# EasyEDA Pro project Source_Boat-Board.epro, board PCB2_2
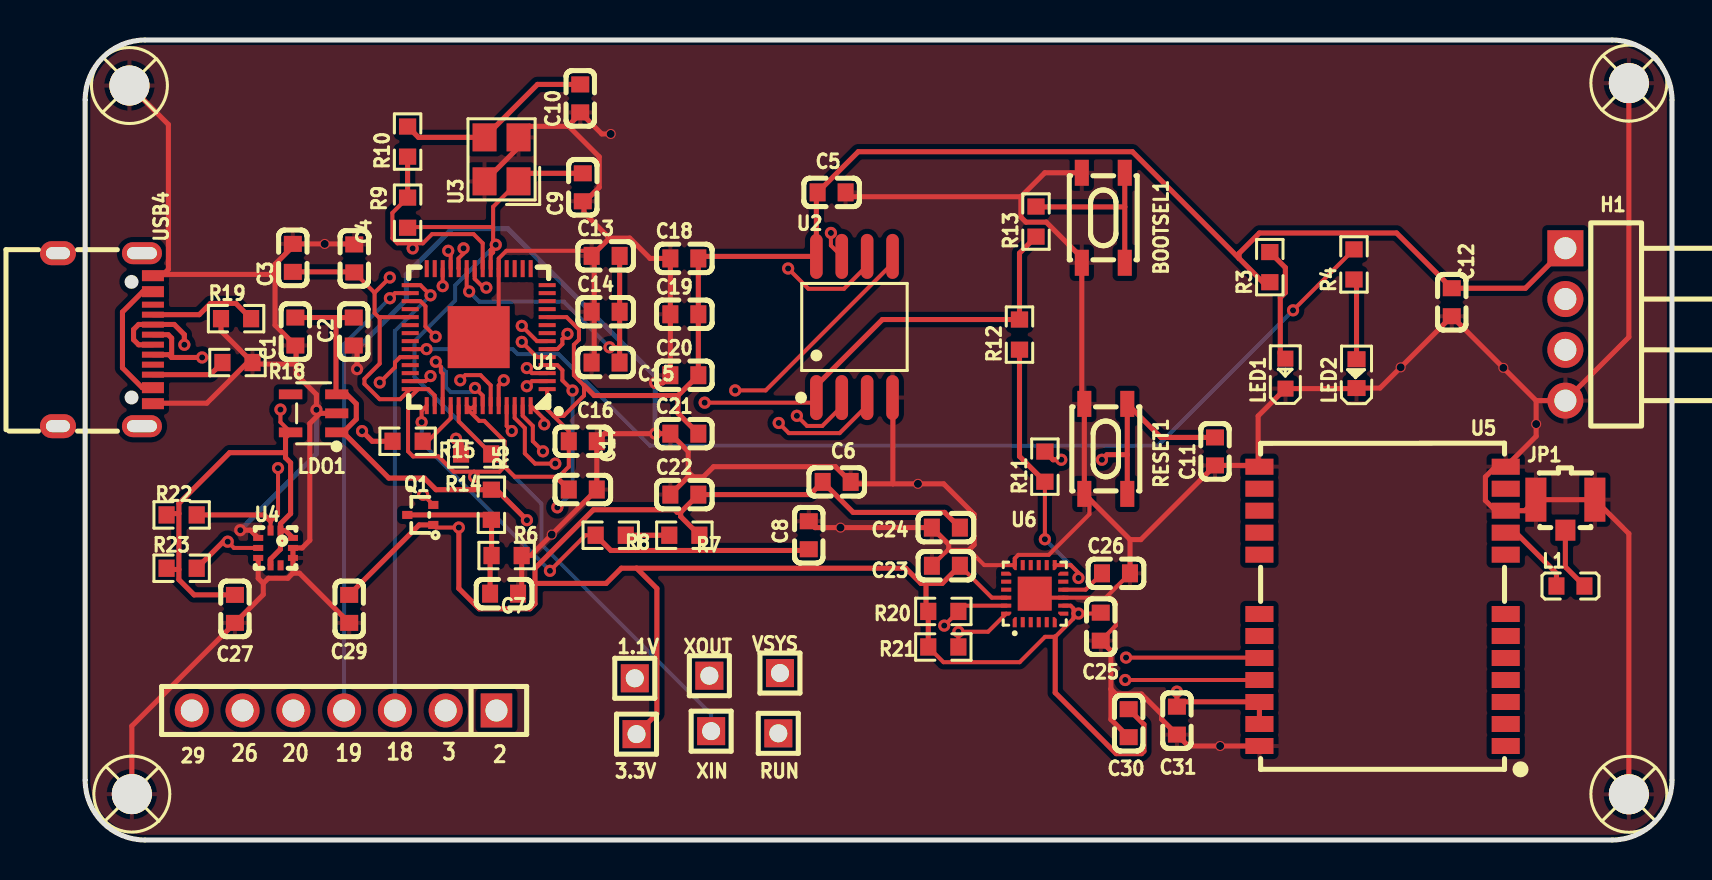
[diagram p5: board, top side]
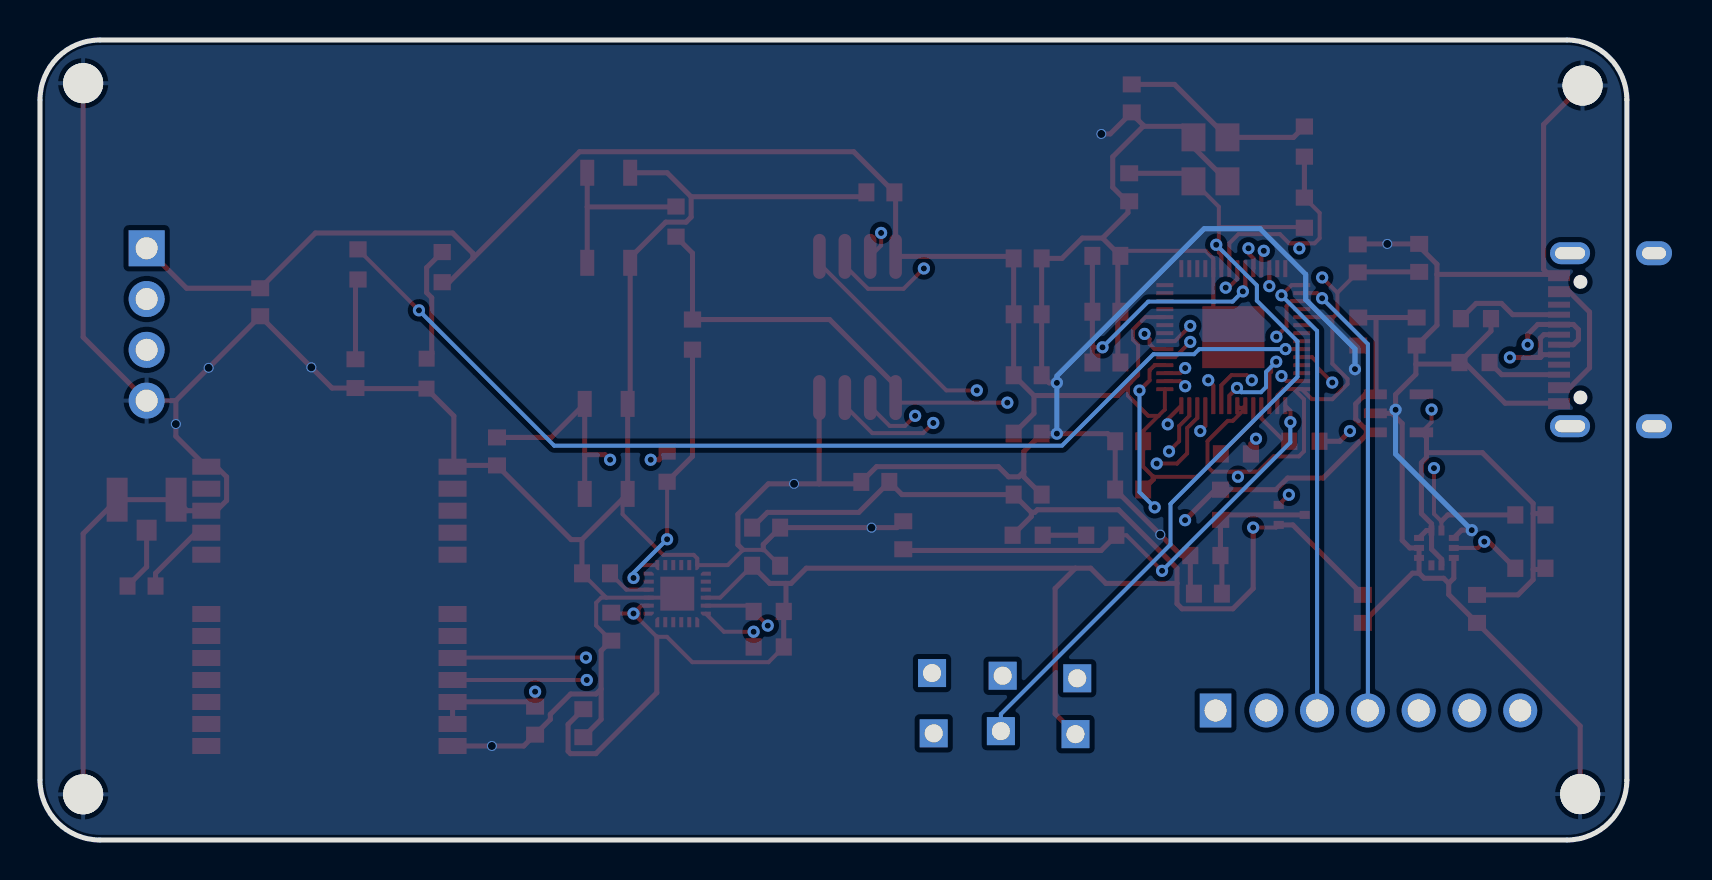
[diagram p6: board, bottom side, seen from below]

Outline 79.37 x 40 mm; copper layers: Top Layer, Inner1, Inner2, Bottom Layer. Coordinates in mm from the lower left corner of the outline.
Outline path: 0,37 0,3 arc(0.88,0.88) 3,0 76.37,0 arc(78.5,0.88) 79.37,3 79.37,37 arc(78.5,39.13) 76.37,40 3,40 arc(0.88,39.13) 0,37
Stack: Top Layer 0.035mm Outer layer thickness 1oz / Dielectric1 0.2104mm 7628 RC49% 8.6mil / Inner1 0.0152mm Inner layer thickness / Dielectric2 1.065mm 1.1mm H/HOZ Copper / Inner2 0.0152mm Inner layer thickness / Dielectric3 0.2104mm 7628 RC49% 8.6mil / Bottom Layer 0.035mm Outer layer thickness 1oz

## Design rules (mm)
template: JLCPCB Capability(Two Layers Board)
spacing copperThickness1oz (default): track to track 0.102, other pairs 0.152 to 0.3
spacing copperThickness2oz: track to track 0.203, other pairs 0.152 to 0.3
track width copperThickness1oz (default): min 0.127, default 0.254, max 2.54
track width copperThickness2oz: min 0.203, default 0.254, max 2.54
differential pair differentialPair (default): width min 0.127, default 0.254, max 2.54; gap min 0.152, default 0.152
via viaSize (default): diameter min 0.5, default 0.61, max 10; hole min 0.3, default 0.305, max 6.3

## Placement (name value [footprint] x y rotation side)
1.1V  -  [HDR-TH_1P-V-M_XKB_X4611WV-01I-C28D40]  27.49 8.09 90 top
3.3V  -  [HDR-TH_1P-V-M_XKB_X4611WV-01I-C28D40]  27.58 5.29 90 top
29  -  [HDR-TH_7P-P2.54-V-F]  12.95 6.48 180 top
BOOTSEL1  PTS815SJK250SMTRLFS  [SW-SMD_4P-L4.2-W3.3-P2.15-LS5.1]  50.93 31.12 90 top
C1  2.2uF  [C0603]  10.51 25.43 90 top
C2  100nF  [C0603]  13.44 25.43 90 top
C3  2.2uF  [C0603]  10.39 29.11 90 top
C4  100nF  [C0603]  13.46 29.08 270 top
C5  100nF  [C0603]  37.34 32.39 0 top
C6  2.2uF  [C0603]  37.59 17.91 0 top
C7  100nF  [C0603]  20.95 12.32 180 top
C8  2.2uF  [C0603]  36.2 15.24 90 top
C9  15pF  [C0603]  24.89 32.64 90 top
C10  15pF  [C0603]  24.77 37.08 90 top
C11  100nF  [C0603]  56.52 19.43 90 top
C12  100nF  [C0603]  68.36 26.89 270 top
C13  100nF  [C0603]  26.03 29.21 0 top
C14  100nF  [C0603]  26.03 26.42 0 top
C15  2.2uF  [C0603]  26.03 23.88 180 top
C16  2.2uF  [C0603]  24.89 19.94 0 top
C17  100nF  [C0603]  24.89 17.53 180 top
C18  100nF  [C0603]  29.97 29.08 0 top
C19  100nF  [C0603]  29.97 26.29 0 top
C20  100nF  [C0603]  29.97 23.24 0 top
C21  100nF  [C0603]  29.97 20.32 0 top
C22  100nF  [C0603]  29.97 17.27 0 top
C23  100nF  [C0603]  43.05 13.71 0 top
C24  2.2uF  [C0603]  43.05 15.62 180 top
C25  100nF  [C0603]  50.8 10.67 90 top
C26  100nF  [C0603]  51.56 13.34 0 top
C27  100nF  [C0603]  7.49 11.56 90 top
C29  100nF  [C0603]  13.21 11.56 90 top
C30  100nF  [C0603]  52.2 5.84 90 top
C31  2.2uF  [C0603]  54.61 5.97 270 top
H1  DZ254W-11-04-65  [HDR-TH_4P-P2.54-H-M-W10.3]  74.04 25.78 270 top
JP1  6GHz  [RF-SMD_FRF05002-JSS103M]  74.04 16.26 0 top
L1  33nH  [L0603]  74.3 12.7 0 top
LDO1  ME6211C33M5G-N  [SOT-23-5_L3.0-W1.7-P0.95-LS2.8-BL]  11.43 21.34 90 top
LED1  NCD0603R1  [LED0603-RD_RED]  60.04 23.32 90 top
LED2  19-217/BHC-ZL1M2RY/3T  [LED0603-FD_BLUE]  63.59 23.32 90 top
Q1  DMG1012T-7  [SOT-523-3_L1.6-W0.8-P1.00-LS1.6-BR]  16.76 16.26 0 top
R3  1kΩ  [R0603]  59.26 28.65 90 top
R4  470Ω  [R0603]  63.47 28.78 90 top
R5  200kΩ  [R0603]  20.32 16.76 270 top
R6  100kΩ  [R0603]  21.08 14.22 180 top
R7  200Ω  [R0603]  29.97 15.24 180 top
R8  1Ω  [R0603]  26.29 15.24 180 top
R9  NO FIT  [R0603]  16.13 31.37 90 top
R10  1kΩ  [R0603]  16.13 34.92 90 top
R11  10kΩ  [R0603]  48.01 18.67 90 top
R12  NO-FIT  [R0603]  46.74 25.27 90 top
R13  1kΩ  [R0603]  47.56 30.92 90 top
R14  27Ω  [R0603]  19.56 19.3 180 top
R15  27Ω  [R0603]  16.13 19.94 180 top
R18  5.1K  [R0603]  7.62 23.88 180 top
R19  5.1K  [R0603]  7.55 26.07 0 top
R20  4.7K  [R0603]  42.93 11.43 180 top
R21  4.7K  [R0603]  42.93 9.65 180 top
R22  4.7K  [R0603]  4.83 16.26 180 top
R23  4.7K  [R0603]  4.83 13.59 180 top
RESET1  PTS815SJK250SMTRLFS  [SW-SMD_4P-L4.2-W3.3-P2.15-LS5.1]  51.05 19.56 90 top
RUN   -  [HDR-TH_1P-V-M_XKB_X4611WV-01I-C28D40]  34.67 5.33 90 top
SCREW1  -  [Screw-Hole-M2]  77.22 2.29 0 top
SCREW2  -  [Screw-Hole-M2]  77.22 37.85 0 top
SCREW3  -  [Screw-Hole-M2]  2.22 37.73 0 top
SCREW4  -  [Screw-Hole-M2]  2.33 2.3 0 top
U1  RP2040  [LQFN-56_L7.0-W7.0-P0.4-EP]  19.68 25.15 180 top
U2  W25Q128JVSIQ  [SOIC-8_L5.3-W5.3-P1.27-LS8.0-BL]  38.48 25.65 0 top
U3  12MHz  [CRYSTAL-SMD_4P-L3.2-W2.5-BL]  20.83 34.04 90 top
U4  BMP388  [SENSORM-SMD_BMP388]  9.52 14.61 0 top
U5  M216Z-D80  [LCC-24_L16.3-W12.2_NEO-NEO-M10]  64.9 11.68 270 top
U6  ICM-20948  [QFN-24_L3.0-W3.0-P0.40-BL-EP]  47.5 12.32 0 top
USB4  TYPE-C 16PIN 2MD(073)  [USB-C-SMD_TYPE-C-16PIN-2MD-073]  1.02 25.02 270 top
VSYS  -  [HDR-TH_1P-V-M_XKB_X4611WV-01I-C28D40]  34.75 8.35 90 top
XIN  -  [HDR-TH_1P-V-M_XKB_X4611WV-01I-C28D40]  31.31 5.44 90 top
XOUT  -  [HDR-TH_1P-V-M_XKB_X4611WV-01I-C28D40]  31.22 8.21 90 top

## Footprints (pads in the part's own frame, mm; a bottom-side part is the same pattern mirrored in y, then rotated)
C0603
  rect 0.8x0.9 smd: 1(-0.7,0) 2(0.7,0)
CRYSTAL-SMD_4P-L3.2-W2.5-BL
  rect 1.4x1.2 smd: 1(-1.1,-0.85) 2(1.1,-0.85) 3(1.1,0.85) 4(-1.1,0.85)
HDR-TH_1P-V-M_XKB_X4611WV-01I-C28D40
  rect 1.4x1.4 hole 0.9: 1(0,0)
HDR-TH_4P-P2.54-H-M-W10.3
  rect 1.8x1.8 hole 1.1: 1(-3.81,0)
  round 1.8 hole 1.1: 2(-1.27,0) 3(1.27,0) 4(3.81,0)
HDR-TH_7P-P2.54-V-F
  rect 1.575x1.7 hole 1.1: 1(-7.62,0)
  round 1.7 hole 1.1: 2(-5.08,0) 3(-2.54,0) 4(0,0) 5(2.54,0) 6(5.08,0) 7(7.62,0)
L0603
  rect 0.8x0.864 smd: 1(-0.7,0) 2(0.7,0)
LCC-24_L16.3-W12.2_NEO-NEO-M10
  rect 0.8x1.403 smd: 1(6.983,6.16) 2(5.883,6.16) 3(4.783,6.16) 4(3.683,6.16) 5(2.583,6.16) 6(1.483,6.16) 7(0.383,6.16) 8(-2.583,6.16) 9(-3.683,6.16) 10(-4.783,6.16) 11(-5.883,6.16) 12(-6.983,6.16) 13(-6.983,-6.16) 14(-5.883,-6.16) 15(-4.783,-6.16) 16(-3.683,-6.16) 17(-2.583,-6.16) 18(0.383,-6.16) 19(1.483,-6.16) 20(2.583,-6.16) 21(3.683,-6.16) 22(4.783,-6.16) 23(5.883,-6.16) 24(6.983,-6.16)
LED0603-FD_BLUE
  rect 0.8x0.9 smd: 1(-0.72,0) 2(0.72,0)
LED0603-RD_RED
  rect 0.8x0.8 smd: 1(-0.749,-0.004) 2(0.749,0.004)
LQFN-56_L7.0-W7.0-P0.4-EP
  rect 0.85x0.2 smd: 1(-3.425,2.6) 2(-3.425,2.2) 3(-3.425,1.8) 4(-3.425,1.4) 5(-3.425,1) 6(-3.425,0.6) 7(-3.425,0.2) 8(-3.425,-0.2) 9(-3.425,-0.6) 10(-3.425,-1) 11(-3.425,-1.4) 12(-3.425,-1.8) 13(-3.425,-2.2) 14(-3.425,-2.6) 29(3.425,-2.6) 30(3.425,-2.2) 31(3.425,-1.8) 32(3.425,-1.4) 33(3.425,-1) 34(3.425,-0.6) 35(3.425,-0.2) 36(3.425,0.2) 37(3.425,0.6) 38(3.425,1) 39(3.425,1.4) 40(3.425,1.8) 41(3.425,2.2) 42(3.425,2.6)
  rect 0.2x0.85 smd: 15(-2.6,-3.425) 16(-2.2,-3.425) 17(-1.8,-3.425) 18(-1.4,-3.425) 19(-1,-3.425) 20(-0.6,-3.425) 21(-0.2,-3.425) 22(0.2,-3.425) 23(0.6,-3.425) 24(1,-3.425) 25(1.4,-3.425) 26(1.8,-3.425) 27(2.2,-3.425) 28(2.6,-3.425) 43(2.6,3.425) 44(2.2,3.425) 45(1.8,3.425) 46(1.4,3.425) 47(1,3.425) 48(0.6,3.425) 49(0.2,3.425) 50(-0.2,3.425) 51(-0.6,3.425) 52(-1,3.425) 53(-1.4,3.425) 54(-1.8,3.425) 55(-2.2,3.425) 56(-2.6,3.425)
  rect 3.1x3.1 smd: 57(0,0)
QFN-24_L3.0-W3.0-P0.40-BL-EP
  custom 0.2x0.506 smd: 1(-1,-1.427) 6(1,-1.427) 13(1,1.427) 18(-1,1.427)
  rect 0.2x0.505 smd: 2(-0.6,-1.427) 3(-0.2,-1.427) 4(0.2,-1.427) 5(0.6,-1.427) 14(0.6,1.427) 15(0.2,1.427) 16(-0.2,1.427) 17(-0.6,1.427)
  custom 0.506x0.2 smd: 7(1.427,-1) 12(1.427,1) 19(-1.427,1) 24(-1.427,-1)
  rect 0.505x0.2 smd: 8(1.427,-0.6) 9(1.427,-0.2) 10(1.427,0.2) 11(1.427,0.6) 20(-1.427,0.6) 21(-1.427,0.2) 22(-1.427,-0.2) 23(-1.427,-0.6)
  rect 1.7x1.7 smd: 25(0,0)
R0603
  rect 0.806x0.864 smd: 1(-0.753,0) 2(0.753,0)
RF-SMD_FRF05002-JSS103M
  rect 1x1.05 smd: 1(0,-0.762)
  rect 1.05x2.2 smd: 2(-1.475,0.762) 3(1.475,0.762)
Screw-Hole-M2
  round 2 hole 2: 1(0,0)
SENSORM-SMD_BMP388
  rect 0.3x0.5 smd: 1(0.25,0.871) 2(-0.25,0.871) 6(-0.25,-0.871) 7(0.25,-0.871)
  rect 0.5x0.3 smd: 3(-0.869,0.5) 4(-0.869,0) 5(-0.869,-0.5) 8(0.869,-0.5) 9(0.869,0) 10(0.869,0.5)
SOIC-8_L5.3-W5.3-P1.27-LS8.0-BL
  oval 0.63x2.25 smd: 1(-1.905,-3.53) 2(-0.635,-3.53) 3(0.635,-3.53) 4(1.905,-3.53) 5(1.905,3.53) 6(0.635,3.53) 7(-0.635,3.53) 8(-1.905,3.53)
SOT-23-5_L3.0-W1.7-P0.95-LS2.8-BL
  rect 0.49x1.157 smd: 1(-0.95,-1.153) 2(0,-1.153) 3(0.95,-1.153)
  rect 0.49x1.175 smd: 4(0.95,1.153) 5(-0.95,1.153)
SOT-523-3_L1.6-W0.8-P1.00-LS1.6-BR
  rect 0.51x0.4 smd: 1(0.65,-0.5) 2(0.65,0.5) 3(-0.65,0)
SW-SMD_4P-L4.2-W3.3-P2.15-LS5.1
  rect 1.3x0.701 smd: 1(-2.251,1.075) 2(2.251,1.075) 3(-2.251,-1.075) 4(2.251,-1.075)
USB-C-SMD_TYPE-C-16PIN-2MD-073
  oval 1.1x2 hole 0.6x1.5: 13(-4.325,1.825) 14(4.325,1.825)
  oval 1.2x1.8 hole 0.6x1.2: 13(-4.325,-2.375) 14(4.325,-2.375)
  rect 0.55x1.1 smd: A1B12(-3.2,2.375) A4B9(-2.4,2.375) B1A12(3.2,2.375) B4A9(2.4,2.375)
  rect 0.3x1.1 smd: A5(-1.25,2.375) A6(-0.25,2.375) A7(0.25,2.375) A8(1.25,2.375) B5(1.75,2.375) B6(0.75,2.375) B7(-0.75,2.375) B8(-1.75,2.375)

## Nets
1V1: 1.1V.1 C13.2 C14.2 C15.1 U1.23 U1.45 U1.50
3V3: 3.3V.1 C3.1 C4.2 C5.1 C6.1 C12.1 C16.1 C17.2 C18.2 C19.2 C20.2 C21.2 C22.2 C23.2 C24.1 C25.2 C27.2 C29.2 C30.2 C31.1 H1.1 LDO1.5 Q1.1 R3.1 R7.1 R11.1 R12.1 R20.2 R21.2 R22.2 R23.2 U1.1 U1.10 U1.22 U1.33 U1.42 U1.44 U1.48 U1.49 U2.8 U4.1 U4.6 U4.10 U5.22 U5.23 U6.8 U6.13 U6.22
GND: BOOTSEL1.1 BOOTSEL1.2 C1.1 C2.1 C3.2 C4.1 C5.2 C6.2 C7.1 C8.2 C9.1 C10.1 C11.1 C12.2 C13.1 C14.1 C15.2 C16.2 C17.1 C18.1 C19.1 C20.1 C21.1 C22.1 C23.1 C24.2 C25.1 C26.2 C27.1 C29.1 C30.1 C31.2 H1.4 JP1.2 JP1.3 LDO1.2 LED1.1 LED2.1 R6.1 R18.1 R19.1 RESET1.1 RESET1.2 SCREW1.1 SCREW2.1 SCREW3.1 SCREW4.1 U1.19 U1.57 U2.4 U3.2 U3.4 U4.3 U4.5 U4.8 U4.9 U5.10 U5.12 U5.13 U5.24 U6.9 U6.18 U6.25 USB4.A1B12 USB4.B1A12
VBUS: USB4.A4B9 USB4.B4A9
ADC_AVDD: C8.1 R8.2 U1.43
ADC_VREF: R7.2 R8.1
ANTENA: JP1.1 L1.2
GPIO25: R4.2 U1.37
GPIO29_ADC3: 29.7 Q1.2 U1.41
GPSRX: U1.2 U5.21
GPSTX: U1.3 U5.20
IO2: 29.1 U1.4
IO3: 29.2 U1.5
IO18: 29.3 U1.29
IO19: 29.4 U1.30
IO20: 29.5 U1.31
IO26: 29.6 U1.38
QSPI_SCLK: U1.52 U2.6
QSPI_SD0: U1.53 U2.5
QSPI_SD1: U1.55 U2.2
QSPI_SD2: U1.54 U2.3
QSPI_SD3: U1.51 U2.7
QSPI_SS: R12.2 R13.1 U1.56 U2.1
RUN: C11.2 R11.2 RESET1.3 RESET1.4 RUN .1 U1.26
SCL: R20.1 R22.1 U1.7 U4.2 U6.23
SDA: R21.1 R23.1 U1.6 U4.4 U6.24
SWCLK: H1.3 U1.24
SWD: H1.2 U1.25
USBD+: R14.2 USB4.A6 USB4.B6
USBD-: R15.2 USB4.A7 USB4.B7
VSYS: C1.2 C2.2 LDO1.1 LDO1.3 R5.1 VSYS.1
XIN: C9.2 R9.1 U1.20 U3.1 XIN.1
XOUT: R9.2 R10.1 U1.21 XOUT.1
$1N19406: LED1.2 R3.2
$1N19408: LED2.2 R4.1
$1N19463: BOOTSEL1.3 BOOTSEL1.4 R13.2
$1N19510: R14.1 U1.47
$1N19539: R15.1 U1.46
$1N19579: C10.2 R10.2 U3.3
$1N19631: C7.2 Q1.3 R5.2 R6.2
$1N20843: R19.2 USB4.A5
$1N20865: R18.2 USB4.B5
$1N24212: C26.1 U6.10
$1N25598: L1.1 U5.9

Pads without a net: LDO1 4; U1 8 9 11 12 13 14 15 16 17 18 27 28 32 34 35 36 39 40; U4 7; U5 1 2 3 4 5 6 7 8 11 14 15 16 17 18 19; U6 1 2 3 4 5 6 7 11 12 14 15 16 17 19 20 21; USB4 13 14 A8 B8

## Via types
v1: diameter 0.61, hole 0.305, Top Layer to Bottom Layer, 65 vias
v2: diameter 0.5, hole 0.4, Top Layer to Bottom Layer, 9 vias

## Routing (per net, layer and track width the routed paths; a pad name or vN(x,y) marks a point on that pad's centre or on a via; arc(x,y) is an arc through that point)
1V1: length 47.7
  Top Layer w0.2: 19.89,21.72 19.89,22.22 v1(19.5,22.61) ; U1.45 17.88,23.32 17.79,23.41 17.79,23.66 v1(17.54,23.92) ; 26.73,24.64 v1(26.23,24.64) ; v1(19.21,27.43) 19.08,27.56 U1.23
  Top Layer w0.254: 26.73,23.88 C14.2 C13.2
  Inner1 w0.2: 1.1V.1 27.37,8.21 27.37,13.72 23.82,17.27 23.56,17.27 19.5,21.34 v1(19.5,22.61)
  Inner2 w0.2: v1(19.5,22.61) 20.01,22.1 23.18,22.1 25.72,24.64 v1(26.23,24.64)
  Bottom Layer w0.2: v1(19.5,22.61) 19.29,22.39 18.3,22.39 18.05,22.65 18.05,23.41 v1(17.54,23.92) ; v1(19.21,27.43) 19.72,26.92 23.94,26.92 v1(26.23,24.64)
3V3: length 287.5
  Top Layer w0.2: 23.43,21.21 24.19,20.45 C16.1 24.19,18.67 23.69,18.17 21.49,18.17 20.98,18.67 ; 23.43,21.21 23.94,21.21 24.95,22.23 24.95,22.73 24.45,23.24 24.45,24.77 24.7,25.02 24.7,25.53 24.08,26.15 U1.10 ; 23.43,21.21 23.11,21.53 U1.1 ; C23.2 45.35,12.12 U6.22 ; 19.45,18.42 v1(19.45,18.17) ; 19.45,18.42 20.72,18.42 20.98,18.67 ; 19.45,18.42 18.44,18.42 17.68,19.18 16.41,19.18 16.15,19.44 16.15,22.04 16.66,22.55 ; 14.73,26.1 14.78,26.15 U1.33 ; 14.73,26.1 14.73,23.82 13.97,23.06 13.97,22.8 14.73,22.04 15.76,22.04 U1.42 16.66,22.55 ; 14.73,26.1 14.48,26.35 14.48,27.37 ; 49.43,11.33 50.76,11.33 C25.2 ; 49.43,11.33 49.43,11.07 48.52,10.16 48.01,10.16 46.74,8.89 42.93,8.89 R21.2 ; 49.43,11.33 49.43,11.58 49.29,11.72 U6.8 ; v1(9.77,21.53) 9.77,20.89 LDO1.5 ; v1(18.69,15.62) 17.55,15.62 Q1.1 ; 16.66,22.55 17.17,22.55 17.48,22.23 17.48,21.72 ; C4.2 14.48,27.37 ; 14.48,27.37 v1(15.24,28.13) ; 19.2,21.61 19.2,21.47 19.71,20.96 19.96,20.96 20.98,19.94 20.98,18.67 ; 19.2,21.61 U1.48 ; 19.2,21.61 19.37,21.61 U1.49 ; v1(48.01,15.04) R11.1 ; v1(49.69,13.1) 49.69,13.36 49.3,13.75 U6.13 ; v1(20.07,27.62) 19.93,27.62 19.48,28.06 U1.22
  Top Layer w0.254: 48.52,10.16 48.52,7.37 51.57,4.32 52.84,4.32 52.96,4.44 52.96,5.78 C30.2 ; 24.95,22.73 25.46,22.23 29.66,22.23 ; 27.58,13.59 26.82,13.59 26.06,12.83 22.5,12.83 ; 27.58,13.59 41.04,13.59 41.81,12.83 42.06,12.83 ; 27.58,13.59 28.6,12.58 28.6,6.31 3.3V.1 ; H1.1 72.04,27.59 C12.1 65.6,30.35 58.74,30.35 57.72,29.34 57.72,29.08 ; C29.2 16.71,15.76 Q1.1 ; U5.23 U5.22 58.73,6.91 54.61,6.91 ; 42.06,12.83 42.87,12.83 C23.2 ; 42.06,12.83 42.06,11.54 R20.2 R21.2 ; 29.66,22.23 29.66,21.34 C21.2 ; 29.66,22.23 C20.2 C19.2 C18.2 30.77,29.18 U2.8 36.58,32.32 C5.1 38.67,34.42 52.39,34.42 57.72,29.08 ; LDO1.5 10.02,20.13 10.02,19.37 ; R3.1 58.91,27.89 57.72,29.08 ; R23.2 4.13,13.53 4.69,13.53 ; 4.69,13.53 4.69,13.02 5.45,12.26 7.49,12.26 ; 4.69,13.53 4.69,16.32 ; 22.5,12.83 22.5,13.59 25.42,16.51 29.49,16.51 29.61,16.39 29.79,16.39 ; 22.5,12.83 22.5,11.81 22.25,11.56 19.71,11.56 18.69,12.58 v1(18.69,15.62) ; C4.2 13.44,28.41 C3.1 ; C17.2 23.69,18.03 23.69,18.17 ; 29.79,16.39 29.79,16.18 R7.1 ; 29.79,16.39 C22.2 36.26,17.27 C6.1 38.42,16.38 42.99,16.38 43.75,15.62 ; 54.61,6.91 C31.1 ; 54.61,6.91 v1(54.61,7.42) ; R11.1 46.74,19.19 R12.1 ; R22.2 4.14,16.32 4.69,16.32 ; 4.69,16.32 4.69,16.83 7.23,19.37 10.02,19.37 ; 10.02,19.37 10.02,19.12 10.28,18.86 10.28,16.32 9.77,15.81 9.77,15.56 ; U4.10 10.02,15.48 U4.1 9.77,15.56 ; 9.77,15.56 9.77,14.54 9.26,14.04 9.26,13.75 U4.6
  Inner1 w0.2: v1(9.77,21.53) 9.77,22.66 v1(15.24,28.13) 15.75,28.64 19.05,28.64 v1(20.07,27.62)
  Inner2 w0.2: v1(19.45,18.17) 19.45,16.89 18.69,16.13 v1(18.69,15.62) ; v1(49.69,11.33) v1(49.69,13.1)
  Inner2 w0.254: v1(54.61,7.42) 50.7,11.33 v1(49.69,11.33)
  Bottom Layer w0.2: v1(48.01,15.04) 49.69,13.36 v1(49.69,13.1)
GND: length 338.4
  Top Layer w0.2: C13.1 25.08,29.46 21.07,29.46 20.68,29.08 U1.19 20.68,26.15 U1.57 ; C25.1 51.55,10.72 51.55,11.87 51.3,12.12 51.05,12.12 ; 51.05,12.12 C26.2 ; 51.05,12.12 U6.9 47.7,12.12 U6.25 ; 50.23,17.05 50.23,16.29 48.2,14.26 46.68,14.26 46.5,14.08 U6.18 44.97,13.75 44.21,14.51 43.15,14.51 C23.1
  Top Layer w0.25: C10.1 25.84,35.31 v2(26.29,35.31)
  Top Layer w0.254: 26.22,30.1 27.24,30.1 28.26,29.08 C18.1 C19.1 C20.1 28.89,22.86 v1(28.51,22.86) ; 26.22,30.1 25.46,29.34 ; 26.22,30.1 24.95,31.37 24.95,31.88 ; 8.91,12.84 8.66,13.09 U4.5 ; 8.91,12.84 8.91,12.27 C27.1 2.33,5.7 SCREW4.1 ; 8.91,12.84 9.16,13.09 10.14,13.09 10.39,13.34 ; 25.46,29.34 25.46,26.54 ; 25.46,29.34 C13.1 ; 25.46,26.54 25.46,24.01 C15.2 ; 25.46,26.54 C14.1 ; 11.75,21.34 11.24,20.83 11.24,14.99 10.86,14.61 U4.9 U4.8 10.39,13.34 ; 11.75,21.34 v1(11.57,21.51) 11.57,22.28 10.55,23.29 10.55,23.8 ; 11.75,21.34 LDO1.2 ; C10.1 24.51,36.06 24.19,35.75 24.19,35.69 ; 9.5,28.28 9.5,25.74 C1.1 10.55,24.69 10.55,23.8 ; 9.5,28.28 9.5,28.79 10.51,29.81 ; 9.5,28.28 3.91,28.28 ; 44.21,14.51 44.47,14.76 44.47,16.29 42.94,17.81 v2(41.66,17.81) 40.4,17.81 ; 10.39,13.34 10.72,13.34 C29.1 ; 10.51,29.81 v2(11.98,29.81) 13.44,29.81 C4.1 ; 10.51,29.81 C3.2 ; 30.16,18.42 30.16,18.16 C22.1 ; 30.16,18.42 30.16,19.43 C21.1 v1(28.51,20.32) 25.97,20.32 C16.2 C17.1 v2(23.34,15.27) 22.29,14.22 R6.1 21.84,12.5 C7.1 ; 30.16,18.42 30.42,18.16 30.93,18.16 31.43,18.67 37.53,18.67 C6.2 38.39,17.81 40.4,17.81 ; 51.31,7.56 51.31,9.46 C25.1 ; 51.31,7.56 51.56,7.3 52.83,7.3 53.85,6.28 53.85,6.03 C31.2 55.18,4.7 v2(56.77,4.7) U5.24 ; 51.31,7.56 51.31,6.03 C30.1 ; 24.95,31.88 C9.1 ; 24.95,31.88 25.72,32.64 25.72,34.16 24.19,35.69 ; 43.2,14.51 43.2,14.78 C24.2 v2(37.78,15.62) 36.51,15.62 C8.2 ; 58.67,18.73 U5.13 ; 58.67,18.73 C11.1 52.81,15.02 52.27,15.02 ; 58.67,18.73 58.67,21.2 LED1.1 63.56,22.57 LED2.1 64.77,22.6 v2(65.8,23.64) C12.2 v2(70.94,23.61) 72.58,21.97 ; BOOTSEL1.2 48,33.37 46.8,32.17 ; 10.55,23.8 8.45,23.8 R18.1 8.12,24.13 ; 52.27,15.02 52.27,13.34 ; 52.27,15.02 RESET1.1 RESET1.2 49.85,21.94 BOOTSEL1.1 49.85,29.12 48.07,30.9 47.06,30.9 46.8,31.15 46.8,32.17 ; 3.91,28.28 3.45,28.28 USB4.A1B12 ; 3.91,28.28 4.16,28.54 4.16,35.78 SCREW3.1 ; 46.8,32.17 38.26,32.17 C5.2 ; SCREW2.1 77.22,25.15 H1.4 72.58,21.97 ; 24.19,35.69 22.23,35.69 U3.2 21.68,34.64 U3.4 ; R19.1 6.8,25.45 8.12,24.13 ; 72.58,21.97 v2(72.58,20.8) 72.58,20.19 U5.12 70.55,18.67 70.04,18.16 70.04,16.98 70.55,16.47 U5.10 72.01,16.47 JP1.2 JP1.3 77.22,15.32 SCREW1.1 ; USB4.B1A12 3.42,21.84 6.09,21.84 8.12,23.88 8.12,24.13 ; C2.1 13.6,24.56 v1(13.6,23.55) ; 40.4,17.81 40.4,22.11 U2.4 ; U4.3 8.27,15.49 v1(7.76,15.49)
  Inner1 w0.254: v1(13.6,23.55) v1(11.57,21.51)
  Bottom Layer w0.254: v1(7.76,15.49) 11.57,19.3 v1(11.57,21.51) ; v1(28.51,20.32) v1(28.51,22.86) 28.51,23.2 21.14,30.57 18.35,30.57 16.06,28.28 16.06,27.02 13.6,24.56 v1(13.6,23.55)
VBUS: length 6.7
  Top Layer w0.254: USB4.A4B9 2.88,27.42 1.87,26.4 1.87,23.61 2.86,22.62 USB4.B4A9
ADC_AVDD: length 25
  Top Layer w0.2: U1.43 16.83,21.47 v1(16.83,20.9) ; v1(23.25,13.46) 25.03,15.24 R8.2
  Top Layer w0.254: C8.1 36.13,14.48 26.3,14.48 R8.2
  Bottom Layer w0.2: v1(16.83,20.9) 16.83,19.88 v1(23.25,13.46)
ADC_VREF: length 2.2
  Top Layer w0.254: R7.2 R8.1
ANTENA: length 3.2
  Top Layer w0.254: L1.2 74.04,13.65 JP1.1
GPIO25: length 53.3
  Top Layer w0.2: R4.2 v1(60.42,26.49) ; v1(17.08,24.55) U1.37
  Bottom Layer w0.2: v1(17.08,24.55) 21.39,24.55 21.65,24.29 23.68,24.29 28.25,19.72 53.65,19.72 v1(60.42,26.49)
GPIO29_ADC3: length 24.1
  Top Layer w0.2: Q1.2 v1(16.91,17.26) ; v1(17.28,23.2) 17.02,22.95 U1.41
  Inner1 w0.2: v1(16.91,17.26) 17.41,17.77 17.41,23.06 v1(17.28,23.2)
  Inner2 w0.254: 29.7 16.12,17.26 v1(16.91,17.26)
GPSRX: length 43.8
  Top Layer w0.2: v1(52.02,8) U5.21 ; v1(22.09,22.69) 22.35,22.95 U1.2
  Inner1 w0.2: v1(52.02,8) 37.04,8 22.35,22.69 v1(22.09,22.69)
GPSTX: length 43.8
  Top Layer w0.2: U5.20 58.72,9.12 v1(52.07,9.12) ; U1.3 22.35,23.35 v1(22.09,23.6)
  Inner1 w0.2: v1(52.07,9.12) 36.57,9.12 v1(22.09,23.6)
IO2: length 19.7
  Top Layer w0.2: v1(24.38,22.48) 23.87,22.98 23.87,23.49 23.62,23.75 U1.4
  Inner1 w0.2: 29.1 20.57,13.59 v1(23.62,16.63)
  Bottom Layer w0.2: v1(23.62,16.63) 24.38,17.4 v1(24.38,22.48)
IO3: length 23
  Top Layer w0.2: v1(21.84,24.91) 22.6,24.15 U1.5
  Inner1 w0.2: 29.2 17.78,6.73 17.78,22.88 19.81,24.91 v1(21.84,24.91)
IO18: length 22.7
  Top Layer w0.2: U1.29 16.77,27.75 v1(17.28,27.24)
  Bottom Layer w0.2: v1(17.28,27.24) 15.49,25.46 29.3
IO19: length 22.7
  Top Layer w0.2: v1(15.24,27.09) 15.5,27.35 U1.30
  Bottom Layer w0.2: v1(15.24,27.09) 12.95,24.8 29.4
IO20: length 24.7
  Top Layer w0.2: U1.31 16.77,26.95 17.02,26.69 17.02,25.68 v1(17.53,25.17)
  Inner1 w0.2: v1(17.53,25.17) 16.77,25.17 15.5,23.9 15.5,11.56 29.5
IO26: length 21.4
  Top Layer w0.2: U1.38 15.75,24.15 15.5,23.89 15.5,23.64 v1(14.74,22.88)
  Inner1 w0.2: v1(14.74,22.88) 14.74,13.34 29.6
QSPI_SCLK: length 23.8
  Top Layer w0.2: v1(35.16,28.58) 36.18,27.56 37.96,27.56 39.12,28.72 U2.6 ; U1.52 20.68,22.74 v1(20.94,22.99)
  Inner2 w0.2: v1(35.16,28.58) 34.65,29.09 29.58,29.09 24.75,24.26 21.95,24.26 20.94,23.25 v1(20.94,22.99)
QSPI_SD0: length 24.5
  Top Layer w0.2: U2.5 40.39,28.83 34.04,22.48 v1(32.52,22.48) ; U1.53 21.08,20.7 v1(21.34,20.45)
  Inner2 w0.2: v1(21.34,20.45) 21.59,20.2 23.37,20.2 24.39,21.21 31.24,21.21 v1(32.52,22.48)
QSPI_SD1: length 19.7
  Top Layer w0.2: v1(35.6,21.21) 36.11,20.7 36.87,20.7 37.85,21.68 U2.2 ; 21.89,21.72 21.89,21.21 22.39,20.7 22.39,19.94 v1(22.9,19.44)
  Inner2 w0.2: v1(35.6,21.21) 35.35,21.47 33.31,21.47 31.28,19.44 v1(22.9,19.44)
QSPI_SD2: length 22
  Top Layer w0.2: v1(34.69,20.85) 35.2,20.35 37.74,20.35 39.12,21.72 U2.3 ; v1(23.52,18.82) 22.5,18.82 21.99,19.33 21.99,20.6 21.48,21.11 U1.54
  Inner2 w0.2: v1(23.52,18.82) 32.66,18.82 v1(34.69,20.85)
QSPI_SD3: length 26.1
  Top Layer w0.2: U2.7 37.3,29.73 v1(37.3,30.36) ; U1.51 20.28,22.74 19.78,23.25 19.02,23.25 v1(18.76,22.99)
  Inner2 w0.2: v1(37.3,30.36) 36.8,29.85 25.11,29.85 18.76,23.5 v1(18.76,22.99)
QSPI_SS: length 32
  Top Layer w0.2: v1(30.99,21.87) 36.32,21.87 U2.1 ; v1(22.96,20.79) 22.96,21.04 U1.56
  Top Layer w0.254: R13.1 46.74,29.35 R12.2 39.88,26.03 36.58,22.72 U2.1
  Inner2 w0.2: v1(30.99,21.87) 24.05,21.87 v1(22.96,20.79)
RUN: length 65.9
  Top Layer w0.2: v1(17.88,27.7) U1.26
  Top Layer w0.254: v1(48.83,19.01) 48.41,19.01 R11.2 ; C11.2 53.81,20.13 RESET1.4 52.13,19.27 ; v1(50.86,19.01) 51.11,19.27 52.13,19.27 ; 52.13,19.27 RESET1.3
  Inner2 w0.2: 38.16,8.35 28.25,18.25 22.66,18.25 18.19,22.72 18.19,27.39 v1(17.88,27.7)
  Inner2 w0.254: v1(50.86,19.01) 50.6,19.27 49.08,19.27 v1(48.83,19.01) 35.15,5.33 RUN .1
SCL: length 54.9
  Top Layer w0.2: v1(42.97,10.72) R20.1 43.97,11.72 U6.23 ; U4.2 9.27,15.94 9.65,16.31 v1(9.65,18.6) ; v1(21.84,25.71) 22.6,24.95 U1.7
  Top Layer w0.254: R22.1 8.96,16.26 9.27,15.94
  Inner1 w0.2: v1(42.97,10.72) 37.08,10.72 22.09,25.71 v1(21.84,25.71) 21.59,25.96 17.01,25.96 v1(9.65,18.6)
SDA: length 58.7
  Top Layer w0.2: U4.4 7.44,14.61 v1(7.13,14.92) ; U1.6 23.62,24.55 23.87,24.8 23.87,25.05 v1(24.13,25.31) ; U6.24 45.17,10.41 v1(43.68,10.41) R21.1
  Top Layer w0.254: R23.1 6.91,14.92 v1(7.13,14.92)
  Inner1 w0.2: v1(7.13,14.92) 7.13,17.97 15.49,26.32 23.11,26.32 v1(24.13,25.31) 28.44,20.99 33.61,20.99 43.68,10.92 v1(43.68,10.41)
SWCLK: length 58.3
  Top Layer w0.2: U1.24 18.67,28.58 18.67,29.08 18.93,29.33 v1(18.93,29.59)
  Inner1 w0.2: v1(18.93,29.59) 20.45,28.07 24.77,28.07 28.32,24.51 H1.3
SWD: length 59.2
  Top Layer w0.2: v1(18.16,29.46) 18.28,29.34 U1.25
  Inner1 w0.2: v1(18.16,29.46) 18.16,29.72 19.4,30.96 70.13,30.96 H1.2
USBD+: length 19.7
  Top Layer w0.254: v1(18.55,20.07) 18.8,19.81 R14.2 ; USB4.B6 4.19,24.27 4.33,24.13 ; 4.33,24.13 4.33,25.1 4.15,25.27 USB4.A6 ; 4.33,24.13 v1(5.85,24.13)
  Inner2 w0.254: v1(18.55,20.07) 14.49,24.13 v1(5.85,24.13)
USBD-: length 17.8
  Top Layer w0.254: 3.39,24.77 2.68,24.77 2.42,25.02 2.42,25.53 2.68,25.78 4.45,25.78 4.96,25.27 v1(4.96,24.77) ; v1(13.85,20.45) 14.36,19.94 R15.2
  Inner2 w0.254: v1(13.85,20.45) 8.52,20.45 4.96,24 v1(4.96,24.77)
VSYS: length 38.2
  Top Layer w0.254: 12.9,20.39 15.19,18.1 16.97,18.1 17.55,17.52 R5.1 20.57,17.52 v1(22.1,15.99) ; 12.9,20.39 13.56,21.05 13.56,21.81 13.05,22.32 12.55,22.32 ; 12.9,20.39 LDO1.1 ; 12.55,26.13 12.55,22.32 ; 12.55,26.13 C2.2 ; 12.55,26.13 C1.2 ; 12.55,22.32 LDO1.3
  Inner2 w0.254: VSYS.1 33.51,7.1 30.48,7.1 22.1,15.49 v1(22.1,15.99)
XIN: length 45.4
  Top Layer w0.2: 20.28,29.26 U1.20 ; 20.28,29.26 20.41,29.38 20.41,29.63 ; 20.28,29.26 20.28,29.51 20.41,29.63 ; R9.1 16.16,30.65 20.41,30.65 ; 20.41,29.63 20.41,30.65 ; 20.41,29.63 v1(20.54,29.77) ; 20.41,30.65 20.41,31.67 U3.1
  Top Layer w0.254: U3.1 22.08,33.34 C9.2
  Bottom Layer w0.2: v1(20.54,29.77) 18.51,27.73 18.51,26.97 16.47,24.94 16.47,23.16 22.83,16.81 22.83,14.78 31.31,6.29 XIN.1
XOUT: length 38.4
  Top Layer w0.2: 19.89,28.57 19.89,29.84 19.43,30.3 17.35,30.3 16.89,29.84 16.38,29.84 ; R9.2 15.37,31.36 15.37,30.09 15.62,29.84 16.38,29.84 ; 16.38,29.84 v1(16.38,29.58)
  Top Layer w0.254: R9.2 R10.1
  Inner2 w0.2: XOUT.1 16.38,23.05 v1(16.38,29.58)
$1N19406: length 5.9
  Top Layer w0.254: 59.26,29.4 60.03,28.62 60.03,27.37 59.78,27.12 59.78,24.32 LED1.2
$1N19408: length 4
  Top Layer w0.254: R4.1 63.59,27.9 LED2.2
$1N19463: length 8.9
  Top Layer w0.254: 47.56,31.68 47.58,31.66 52,31.66 ; 52,31.66 BOOTSEL1.4 ; 52,31.66 BOOTSEL1.3
$1N19510: length 3.1
  Top Layer w0.2: U1.47 18.68,20.93 R14.1
$1N19539: length 2.5
  Top Layer w0.2: U1.46 18.28,21.09 17.14,19.94 R15.1
$1N19579: length 10
  Top Layer w0.254: C10.2 22.63,37.78 U3.3 16.67,35.14 R10.2
$1N19631: length 8
  Top Layer w0.254: Q1.3 20.08,16.26 R5.2 20.33,16 R6.2 20.26,14.15 C7.2
$1N20843: length 5.5
  Top Layer w0.254: R19.2 7.54,26.83 6.27,26.83 5.71,26.27 USB4.A5
$1N20865: length 3.7
  Top Layer w0.254: R18.2 6.26,23.27 USB4.B5
$1N24212: length 2.3
  Top Layer w0.2: U6.10 50.05,12.52 C26.1
$1N25598: length 4
  Top Layer w0.254: U5.9 71.56,15.37 73.59,13.34 73.59,12.7

## Copper pours and planes (outline as drawn; the poured copper is in the pictures)
GND on Top Layer: -7.37,44.2 85.73,44.2 85.73,-3.3 -7.37,-3.3
GND on Bottom Layer: -6.98,45.34 87.12,45.34 87.12,-2.41 -6.98,-2.41
GND on Inner1: -8.51,45.72 89.92,45.72 89.92,-2.92 -8.51,-2.92
GND on Inner2: -12.06,47.37 95.89,47.37 95.89,-6.1 -12.06,-6.1

## Text on the board
Top Silkscreen Layer: 26 | 20 | 19 | 18 | 3 | 2
